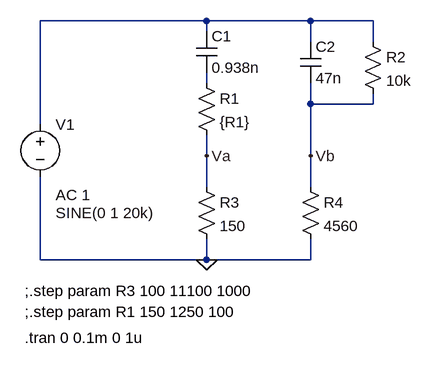
[diagram p0: schematic puente_cserie.asc]
puente_cserie.asc, the LTspice schematic file:
Version 4
SHEET 1 880 680
WIRE 224 -48 -32 -48
WIRE 384 -48 224 -48
WIRE 480 -48 384 -48
WIRE 224 -32 224 -48
WIRE 384 -16 384 -48
WIRE 480 -16 480 -48
WIRE 224 48 224 32
WIRE 384 80 384 48
WIRE 480 80 480 64
WIRE 480 80 384 80
WIRE -32 112 -32 -48
WIRE 224 160 224 128
WIRE 384 160 384 80
WIRE 224 208 224 160
WIRE 384 208 384 160
WIRE -32 320 -32 192
WIRE 224 320 224 288
WIRE 224 320 -32 320
WIRE 384 320 384 288
WIRE 384 320 224 320
FLAG 224 320 0
FLAG 224 160 Va
FLAG 384 160 Vb
SYMBOL voltage -32 96 R0
WINDOW 3 24 152 Left 2
WINDOW 123 24 124 Left 2
WINDOW 39 0 0 Left 0
SYMATTR Value SINE(0 1 20k)
SYMATTR Value2 AC 1
SYMATTR InstName V1
SYMBOL res 208 32 R0
SYMATTR InstName R1
SYMATTR Value {R1}
SYMBOL cap 208 -32 R0
SYMATTR InstName C1
SYMATTR Value 0.938n
SYMBOL cap 368 -16 R0
SYMATTR InstName C2
SYMATTR Value 47n
SYMBOL res 208 192 R0
SYMATTR InstName R3
SYMATTR Value 150
SYMBOL res 368 192 R0
SYMATTR InstName R4
SYMATTR Value 4560
SYMBOL res 464 -32 R0
SYMATTR InstName R2
SYMATTR Value 10k
TEXT -56 368 Left 2 !;.step param R3 100 11100 1000
TEXT -56 440 Left 2 !.tran 0 0.1m 0 1u
TEXT -56 400 Left 2 !;.step param R1 150 1250 100

The netlist it stands for:
* puente_cserie.asc
V1 N001 0 SINE(0 1 20k) AC 1
R1 N002 Va {R1}
C1 N001 N002 0.938n
C2 N001 Vb 47n
R3 Va 0 150
R4 Vb 0 4560
R2 N001 Vb 10k
;.step param R3 100 11100 1000
.tran 0 0.1m 0 1u
;.step param R1 150 1250 100
.backanno
.end